# Altium schematic sheet 04_GIRIS_CIKIS_EMG_BUTTONS.SchDoc
size A3
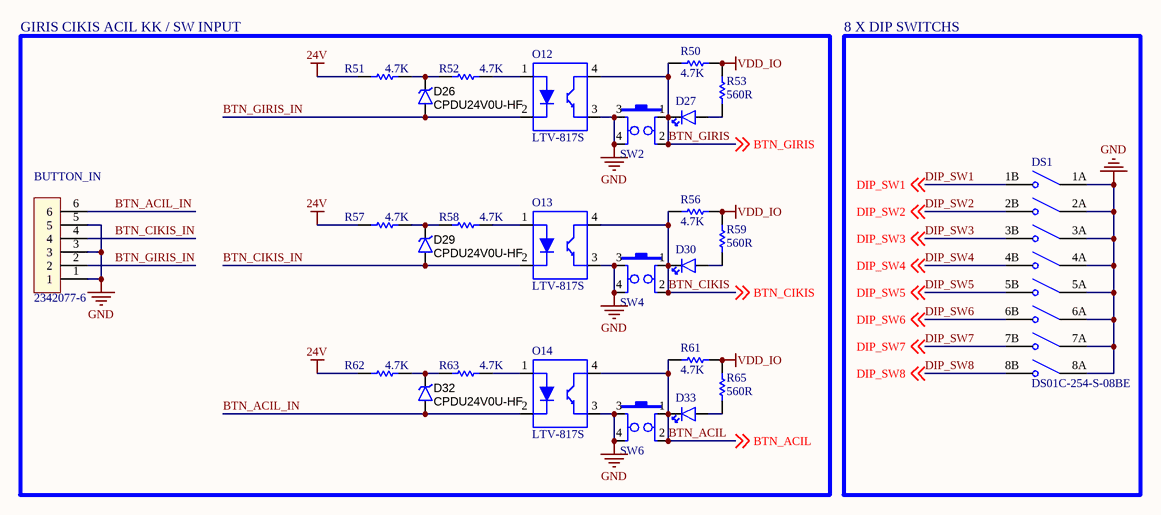
[diagram p0: 04_GIRIS_CIKIS_EMG_BUTTONS.SchDoc]

## Parts
BUTTON_IN  2342077-6  [TERM BLOCK HDR 6POS 90DEG PITCH 3.81MM]
D26  CPDU24V0U-HF  [SOD523F]
D27  led_green  [805LED]  (value not drawn)
D29  CPDU24V0U-HF  [SOD523F]
D30  led_green  [805LED]  (value not drawn)
D32  CPDU24V0U-HF  [SOD523F]
D33  led_green  [805LED]  (value not drawn)
DS1  DS01C-254-S-08BE  [SW_DS01C-254-S-08BE]
O12  LTV-817S  [SMD4-2.54-4.6X6.5MM]
O13  LTV-817S  [SMD4-2.54-4.6X6.5MM]
O14  LTV-817S  [SMD4-2.54-4.6X6.5MM]
R50  4.7K  [603R]
R51  4.7K  [603R]
R52  4.7K  [603R]
R53  560R  [603R]
R56  4.7K  [603R]
R57  4.7K  [603R]
R58  4.7K  [603R]
R59  560R  [603R]
R61  4.7K  [603R]
R62  4.7K  [603R]
R63  4.7K  [603R]
R65  560R  [603R]
SW2  switch tactile  [SW_TACTILE_6X6mm SMT]  (value not drawn)
SW4  switch tactile  [SW_TACTILE_6X6mm SMT]  (value not drawn)
SW6  switch tactile  [SW_TACTILE_6X6mm SMT]  (value not drawn)

## Blocks framed on the sheet
GIRIS CIKIS ACIL KK / SW INPUT: BUTTON_IN D26 D27 D29 D30 D32 D33 O12-O14 R50-R53 R56-R59 R61-R63 R65 SW2 SW4 SW6
8 X DIP SWITCHS: DS1

## Nets
24V: R51.1 R57.1 R62.1
GND: BUTTON_IN.1 BUTTON_IN.3 BUTTON_IN.5 DS1.1A(COM1) DS1.2A(COM2) DS1.3A(COM3) DS1.4A(COM4) DS1.5A(COM5) DS1.6A(COM6) DS1.7A(COM7) DS1.8A(COM8) O12.3(EMITER) O13.3(EMITER) O14.3(EMITER) SW2.3 SW2.4 SW4.3 SW4.4 SW6.3 SW6.4
VDD_IO: R50.2 R53.2 R56.2 R59.2 R61.2 R65.2
BTN_ACIL: D33.2(K) O14.4(COLLECTOR) R61.1 SW6.1 SW6.2 ; off-sheet BTN_ACIL
BTN_ACIL_IN: BUTTON_IN.6 D32.1 O14.2(CATHODE)
BTN_CIKIS: D30.2(K) O13.4(COLLECTOR) R56.1 SW4.1 SW4.2 ; off-sheet BTN_CIKIS
BTN_CIKIS_IN: BUTTON_IN.4 D29.1 O13.2(CATHODE)
BTN_GIRIS: D27.2(K) O12.4(COLLECTOR) R50.1 SW2.1 SW2.2 ; off-sheet BTN_GIRIS
BTN_GIRIS_IN: BUTTON_IN.2 D26.1 O12.2(CATHODE)
DIP_SW1: DS1.1B(NO1) ; off-sheet DIP_SW1
DIP_SW2: DS1.2B(NO2) ; off-sheet DIP_SW2
DIP_SW3: DS1.3B(NO3) ; off-sheet DIP_SW3
DIP_SW4: DS1.4B(NO4) ; off-sheet DIP_SW4
DIP_SW5: DS1.5B(NO5) ; off-sheet DIP_SW5
DIP_SW6: DS1.6B(NO6) ; off-sheet DIP_SW6
DIP_SW7: DS1.7B(NO7) ; off-sheet DIP_SW7
DIP_SW8: DS1.8B(NO8) ; off-sheet DIP_SW8
NetD26_2: D26.2 R51.2 R52.1
NetD27_1: D27.1(A) R53.1
NetD29_2: D29.2 R57.2 R58.1
NetD30_1: D30.1(A) R59.1
NetD32_2: D32.2 R62.2 R63.1
NetD33_1: D33.1(A) R65.1
NetO12_1: O12.1(ANODE) R52.2
NetO13_1: O13.1(ANODE) R58.2
NetO14_1: O14.1(ANODE) R63.2

## Library data of the parts
BUTTON_IN = TERM BLOCK HDR 6POS 90DEG 3.81MM: 6 Position Terminal Block Header, Male Pins, Shrouded (4 Side) 0.150" (3.81mm) 90°, Right Angle - Through Hole; Manufacturer: TE Connectivity AMP Connectors; Contact Tail Length: 0.075" (1.90mm); Digi-Key Part Number: A145325-ND; Value: 2342077-6; Pitch: 0.150" (3.81mm); Header Orientation: 90°, Right Angle; Insulation Height: 0.285" (7.25mm)
D26 D29 D32 = TVS DIODE 24VWM 50V 0603/SOD523F CPDU24V0U-HF: 50V Clamp 3A (8/20µs) Ipp Tvs Diode Surface Mount 0603/SOD-523F; Manufacturer: Comchip Technology; Type: Zener; Voltage - Reverse Standoff (Typ): 24V (Max); Voltage - Breakdown (Min): 26.5V; Power - Peak Pulse: 150W; Power Line Protection: No; Unidirectional Channels: 1; Digi-Key Part Number: 641-1679-1-ND; Manufacturer Part Number: CPDU24V0U-HF; Voltage - Clamping (Max) @ Ipp: 50V; Operating Temperature: -55°C ~ 125°C (TJ); Package / Case: 0603/SOD-523F; Value: CPDU24V0U-HF
D27 D30 D33 = LED_GREEN_0805: LED 2X1.2MM 570NM GN WTR CLR SMD; Millicandela Rating: 50mcd; Voltage - Forward (Vf): 2.1V; value: led_green; Digi-Key Part Number: 754-1127-1-ND; Case: 0805; Viewing Angle: -
DS1 = DIP SWITCH, SPST, 2.54 PITCH, RA DS01C-254-S-08BE: Dip Switch SPST 8 Position Through Hole Slide (Standard) Actuator 25mA 24VDC; Digi-Key Part Number: 2223-DS01C-254-S-08BE-ND; Value: DS01C-254-S-08BE
O12-O14 = OPTOISOLATR 5KV TRANSISTOR 4-SMD LTV-817S: Optoisolator Transistor Output 5000Vrms 1 Channel 4-SMD; Voltage - Output (Max): 35V; Number of Channels: 1; Rise / Fall Time (Typ): 4µs, 3µs; Current - DC Forward (If) (Max): 50 mA; Voltage - Forward (Vf) (Typ): 1.2V; Output Type: Transistor; Voltage - Isolation: 5000Vrms; Package / Case: 4-SMD, Gull Wing; Operating Temperature: -30°C ~ 110°C; Value: LTV-817S; Digi-Key Part Number: 160-1367-5-ND
R50-R52 R56-R58 R61-R63 = RES_4.7K_OHM_%5_0.1W_0603: 4.7 kOhms ±5% 0.1W, 1/10W Chip Resistor 0603 (1608 Metric) Moisture Resistant Thick Film; Manufacturer: Yageo; Manufacturer Part Number: RC0603JR-074K7L; Temperature Coefficient: ±100ppm/°C; Value: 4.7K; Digi-Key Part Number: 311-4.7KGRTR-ND; Tolerance: ±5%; Power (Watts): 0.1W, 1/10W; Composition: Thick Film; Operating Temperature: -55°C ~ 155°C; Package / Case: 0603 (1608 Metric); Size / Dimension: 0.063" L x 0.032" W (1.60mm x 0.80mm); Height - Seated (Max): 0.022" (0.55mm); Features: Moisture Resistant
R53 R59 R65 = RES_560_OHM_%5_0.1W_0603: 560 Ohms ±5% 0.1W, 1/10W Chip Resistor 0603 (1608 Metric) Moisture Resistant Thick Film; Manufacturer: Yageo; Manufacturer Part Number: RC0603JR-07560RL; Temperature Coefficient: ±100ppm/°C; Value: 560R; Digi-Key Part Number: 311-560GRCT-ND; Tolerance: ±5%; Power (Watts): 0.1W, 1/10W; Composition: Thick Film; Operating Temperature: -55°C ~ 155°C; Package / Case: 0603 (1608 Metric); Size / Dimension: 0.063" L x 0.032" W (1.60mm x 0.80mm); Height - Seated (Max): 0.022" (0.55mm); Features: Moisture Resistant
SW2 SW4 SW6 = SW_TACTILE_6x6x4.3mm SMT: Tactile Switch SPST-NO Top Actuated Surface Mount; Switch Function: Off-Mom; Value: switch tactile; Digi-Key Part Number: CKN9112TR-ND; case: 6.00mm x 6.00mm_H4.30mm